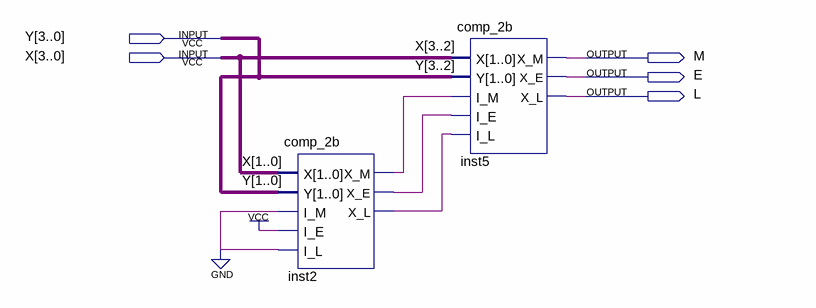
[diagram p0: schematic sheet]
// Quartus schematic Comp_4b.bdf as structural Verilog: 2 symbols, 5 pins
module Comp_4b (
  input  [3:0] Y,
  input  [3:0] X,
  output M,
  output E,
  output L
);

  wire inst2_x_e, inst2_x_l, inst2_x_m;

  comp_2b inst2 (
    .X(X[1:0]), .Y(Y[1:0]), .I_M(1'b0), .I_E(1'b1), .I_L(1'b0), .X_M(inst2_x_m), .X_E(inst2_x_e),
    .X_L(inst2_x_l));
  comp_2b inst5 (.X(X[3:2]), .Y(Y[3:2]), .I_M(inst2_x_m), .I_E(inst2_x_e), .I_L(inst2_x_l), .X_M(M), .X_E(E), .X_L(L));
endmodule
